# Altium schematic sheet misc.SchDoc
size A
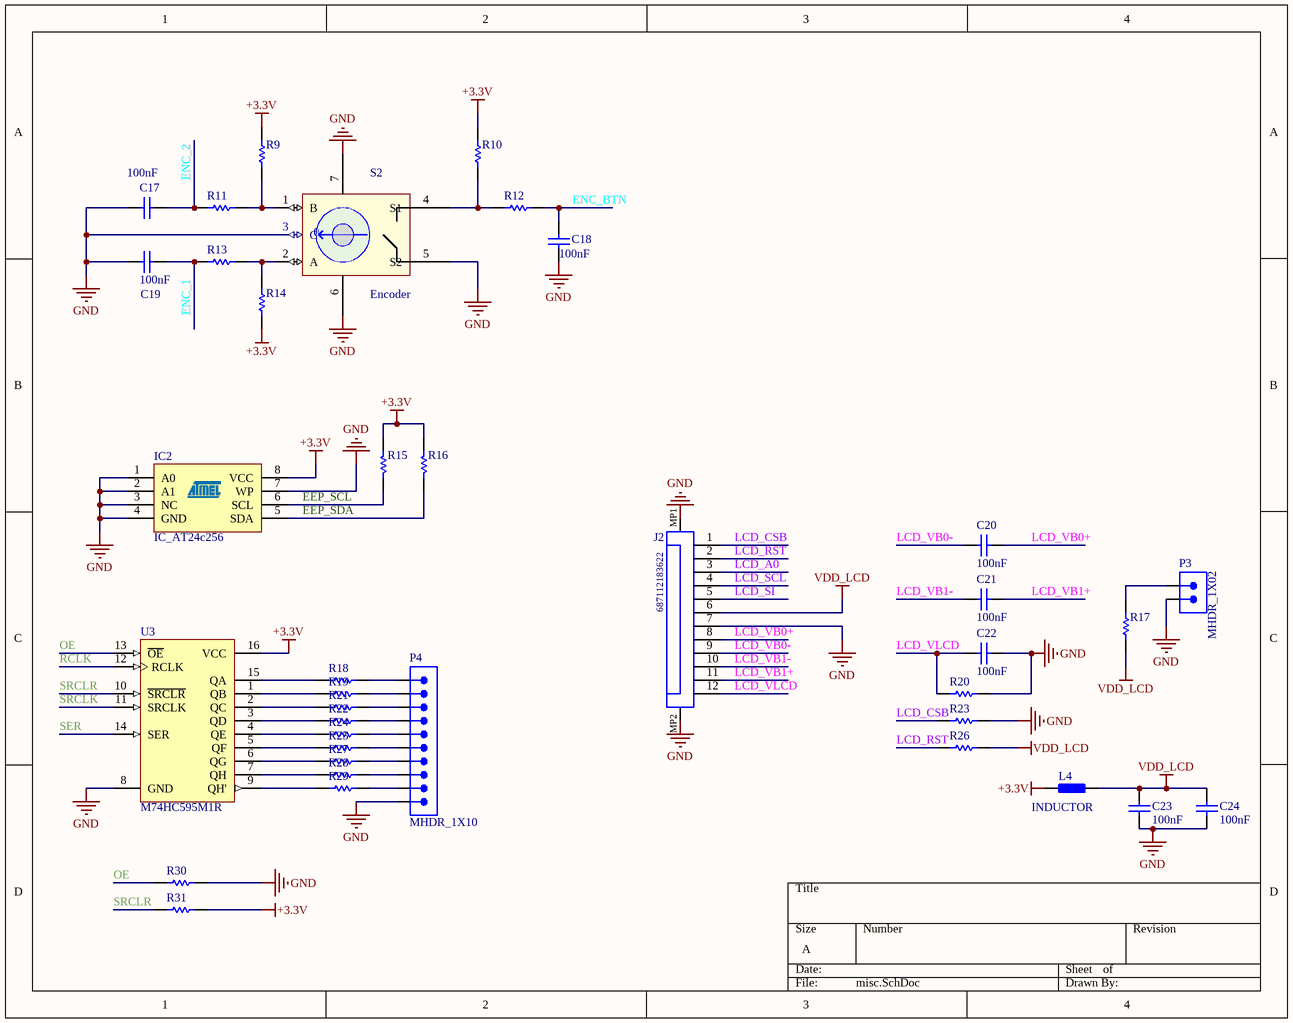
[diagram p0: misc.SchDoc]

## Parts
C17  100nF  [CAPC3216M (1206)]
C18  100nF  [CAPC3216M (1206)]
C19  100nF  [CAPC3216M (1206)]
C20  100nF  [CAPC3216M (1206)]
C21  100nF  [CAPC3216M (1206)]
C22  100nF  [CAPC3216M (1206)]
C23  100nF  [CAPC3216M (1206)]
C24  100nF  [CAPC3216M (1206)]
IC2  IC_AT24c256  [CDIP8]
J2  687112183622  [PCBComponent_1]
L4  INDUCTOR  [INDC4532]
P3  MHDR_1X02  [MHDR1X02-254P]
P4  MHDR_1X10  [MHDR1X10-254P - E]
R9  1K  [RESC3216X60M (1206)]  (value not drawn)
R10  1K  [RESC3216X60M (1206)]  (value not drawn)
R11  1K  [RESC3216X60M (1206)]  (value not drawn)
R12  1K  [RESC3216X60M (1206)]  (value not drawn)
R13  1K  [RESC3216X60M (1206)]  (value not drawn)
R14  1K  [RESC3216X60M (1206)]  (value not drawn)
R15  1K  [RESC3216X60M (1206)]  (value not drawn)
R16  1K  [RESC3216X60M (1206)]  (value not drawn)
R17  1K  [RESC3216X60M (1206)]  (value not drawn)
R18  1K  [RESC3216X60M (1206)]  (value not drawn)
R19  1K  [RESC3216X60M (1206)]  (value not drawn)
R20  1K  [RESC3216X60M (1206)]  (value not drawn)
R21  1K  [RESC3216X60M (1206)]  (value not drawn)
R22  1K  [RESC3216X60M (1206)]  (value not drawn)
R23  1K  [RESC3216X60M (1206)]  (value not drawn)
R24  1K  [RESC3216X60M (1206)]  (value not drawn)
R25  1K  [RESC3216X60M (1206)]  (value not drawn)
R26  1K  [RESC3216X60M (1206)]  (value not drawn)
R27  1K  [RESC3216X60M (1206)]  (value not drawn)
R28  1K  [RESC3216X60M (1206)]  (value not drawn)
R29  1K  [RESC3216X60M (1206)]  (value not drawn)
R30  1K  [RESC3216X60M (1206)]  (value not drawn)
R31  1K  [RESC3216X60M (1206)]  (value not drawn)
S2  Encoder  [Encoder]
U3  M74HC595M1R  [SO16_L]

## Nets
+3.3V: IC2.8(VCC) L4.1 R9.2 R10.2 R14.1 R15.1 R16.1 R31.1 U3.16(VCC)
GND: C17.1(+) C18.2(-) C19.1(+) C22.2(-) C23.2(-) C24.2(-) IC2.1(A0) IC2.2(A1) IC2.3(NC) IC2.4(GND) IC2.7(WP) J2.7 J2.MP1 J2.MP2 P3.2 P4.10 R20.1 R23.1 R30.1 S2.3(C) S2.5(S2) S2.6(CHASIS) S2.7(CHASIS) U3.8(GND)
VDD_LCD: C23.1(+) C24.1(+) J2.6 L4.2 R17.2 R26.1
EEP_SCL: IC2.6(SCL) R15.2
EEP_SDA: IC2.5(SDA) R16.2
ENC_1: C19.2(-) R13.2
ENC_2: C17.2(-) R11.2
ENC_BTN: C18.1(+) R12.1
LCD_A0: J2.3
LCD_CSB: J2.1 R23.2
LCD_RST: J2.2 R26.2
LCD_SCL: J2.4
LCD_SI: J2.5
LCD_VB0+: C20.1(+) J2.8
LCD_VB0-: C20.2(-) J2.9
LCD_VB1+: C21.1(+) J2.11
LCD_VB1-: C21.2(-) J2.10
LCD_VLCD: C22.1(+) J2.12 R20.2
OE: R30.2 U3.13(~{OE})
RCLK: U3.12(RCLK)
SER: U3.14(SER)
SRCLK: U3.11(SRCLK)
SRCLR: R31.2 U3.10(~{SRCLR})
NetP3_1: P3.1 R17.1
NetP4_1: P4.1 R18.1
NetP4_2: P4.2 R19.1
NetP4_3: P4.3 R21.1
NetP4_4: P4.4 R22.1
NetP4_5: P4.5 R24.1
NetP4_6: P4.6 R25.1
NetP4_7: P4.7 R27.1
NetP4_8: P4.8 R28.1
NetP4_9: P4.9 R29.1
NetR9_1: R9.1 R11.1 S2.1(B)
NetR10_1: R10.1 R12.2 S2.4(S1)
NetR13_1: R13.1 R14.2 S2.2(A)
NetR18_2: R18.2 U3.15(QA)
NetR19_2: R19.2 U3.1(QB)
NetR21_2: R21.2 U3.2(QC)
NetR22_2: R22.2 U3.3(QD)
NetR24_2: R24.2 U3.4(QE)
NetR25_2: R25.2 U3.5(QF)
NetR27_2: R27.2 U3.6(QG)
NetR28_2: R28.2 U3.7(QH)
NetR29_2: R29.2 U3.9(QH')

## Notes on the sheet
- (in symbol Encoder) 0

## Library data of the parts
C17-C24 = CAP_Bipolar: Bipolar Capacitor; Voltage: 100V; Designer: Eng. Saeid Jorablo; Company: SJ Libraries; ComponentLink1Description: Datasheet; ComponentLink2Description: Reference; Publisher: SJ Unlimited; Mounting Technology: *; Mounting Technology: Surface Mount\Through-Hole; HelpURL: http://s3.picofile.com/file/7443264187/Coming_Soon_logo.gif; Status: Unreleased; Value: 100nF
IC2 = IC_AT24c256: EEPROM Memory; Designer: Eng. Saeid Jorablo; Company: SJ Libraries; Revision 2: 7/1/2012: Add Suppliers; ESD Sensetive: True/False; ComponentLink1Description: Datasheet; ComponentLink1URL: www.datasheet4u.com; ComponentLink2Description: Reference; PinCount: 8; Update: 6/5/2012; Supplier 1: Digi-Key; Supplier 2: Digi-Key; Supplier 3: Digi-Key; Supplier Part Number 1: AT24C256-10TI-2.7-ND; Supplier Part Number 2: AT24C256N-10SC-ND; Supplier Part Number 3: AT24C256-10PI-2.7-ND; Category: Integrated Circuit; Status: Unrelease; HelpURL: http://s3.picofile.com/file/7443264187/Coming_Soon_logo.gif; Operating Temperature: -55 ~ +125 (C); Mounting Technology: Surface Mount; RoHS compliant: True/False
J2 = 687112183622: SMT ZIF Connectors Low Profile WR-FPC, Horizontal, Top Contact, pitch 0.6 mm, 12 pins; Rated Current: 0.4 A; Contact Resistance: 30 mOhm; Withstanding Voltage: 250 VAC; Working Voltage: 50 VAC; Pin Number: 12; Pitch: 0.6 mm; ComponentLink1Description: Manufacturer; ComponentLink1URL: http://www.we-online.de; ComponentLink2Description: Datasheet; ComponentLink2URL: https://katalog.we-online.de/em/datasheet/687112183622.pdf; Part Number: 687112183622; Published Date: August 2018; Publisher: Wurth Elektronik; Operating Temperature: -25 to 85 degC; Packaging: Tape and Reel; Mounting Technology: SMT; Orientation: Horizontal; Contact Design: Top Contact
L4 = INDUCTOR: Code_IEC: 1005; Designer: Eng. Saeid Jorablo; Company: SJ Libraries; Value: 10mH; Published: 8-Jun-2000; LatestRevisionDate: 29-May-2009; LatestRevisionNote: IPC-7351 Footprint Added.; PackageReference: 0402-A; Publisher: SJ Unlimited; PackageDescription: Chip Inductor; Code_JEITA: 0402; ComponentLink1Description: Datasheet; ComponentLink2Description: Reference; Mounting Technology: Surface Mount\Through-Hole; HelpURL: http://s3.picofile.com/file/7443264187/Coming_Soon_logo.gif; Status: Unreleased
P3 = MHDR_1X02: Male Header 1X02
P4 = MHDR_1X10: Male Header 1X10
R9-R31 = RES: Resistor; Designer: Eng. Saeid Jorablo; Company: SJ Libraries; Tolerance: 5%; Power: 1/8 W; Category: Resistors; ComponentLink1Description: Datasheet; ComponentLink2Description: Reference; PackageDescription: SMD & TH Resistors; Publisher: SJ Unlimited; Mounting Technology: Surface Mount\Through-Hole; HelpURL: http://s3.picofile.com/file/7443264187/Coming_Soon_logo.gif; Status: Unreleased; Value: 1K
U3 = M74HC595M1R: 8 Bit Shift Register with Output Latches (3 STATE); Published: 8-Jun-2000; LatestRevisionDate: 13-Apr-2006; LatestRevisionNote: IPC-7351 Footprint Added.; DatasheetVersion: Apr-1993; PackageVersion: May-1998; PackageReference: SO16; Publisher: Altium Limited; PackageDescription: 16-Pin Small Outline Integrated Circuit 1.27 mm Pitch; Code_IPC: SOIC127P600-16; ComponentLink1Description: Manufacturer Link; ComponentLink1URL: http://www.st.com/; ComponentLink2Description: Datasheet; ComponentLink2URL: http://www.st.com/stonline/products/literature/ds/1989/m74hc595.pdf